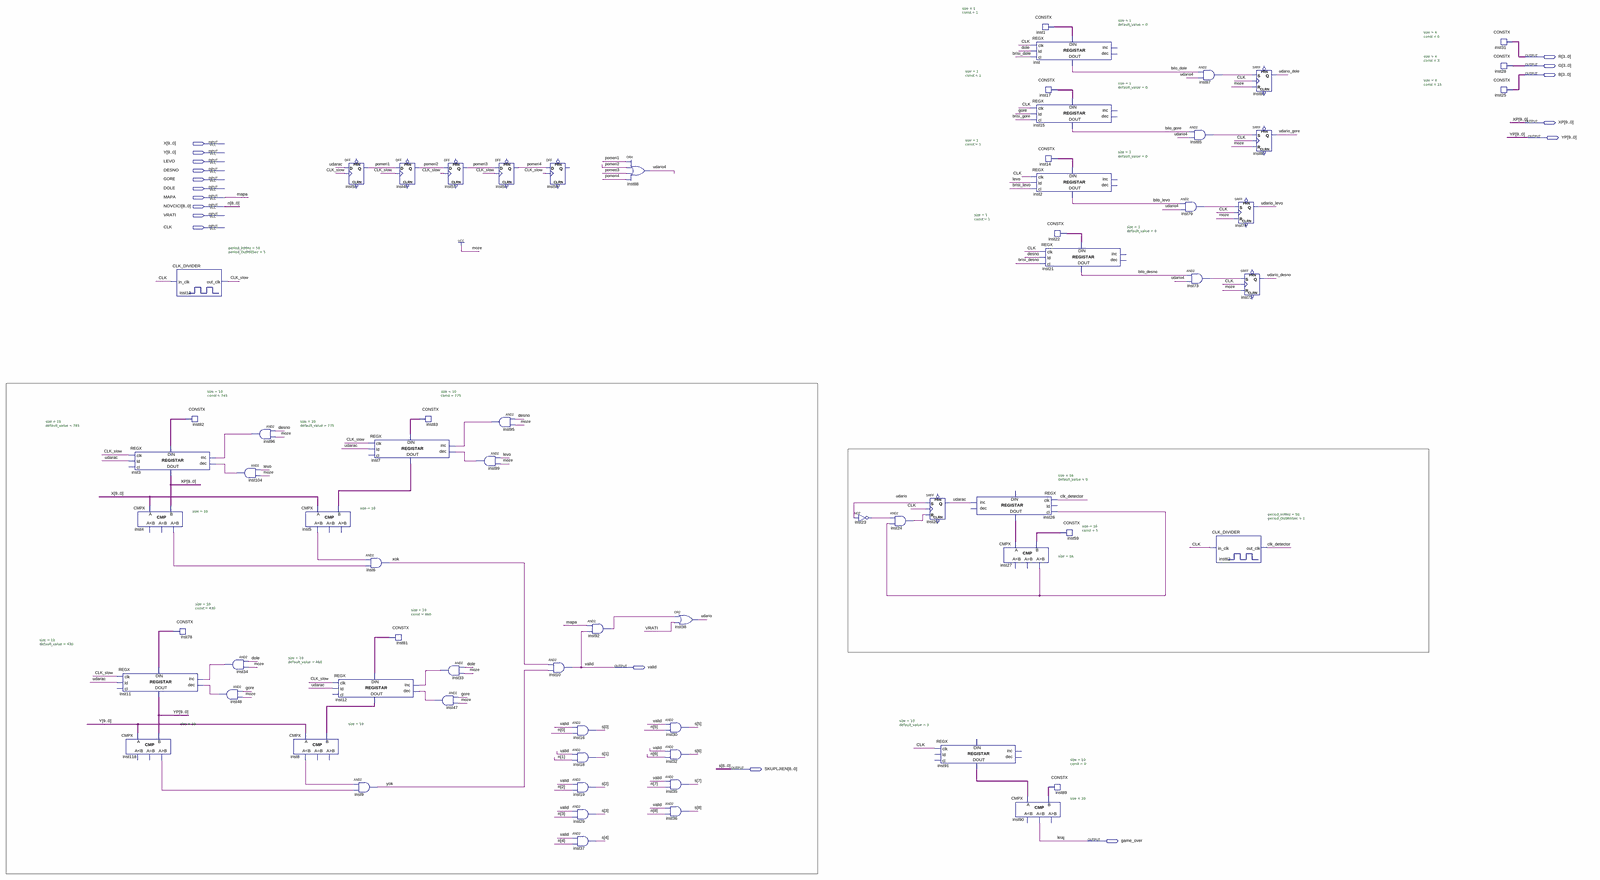
[diagram p0: schematic sheet, whole]
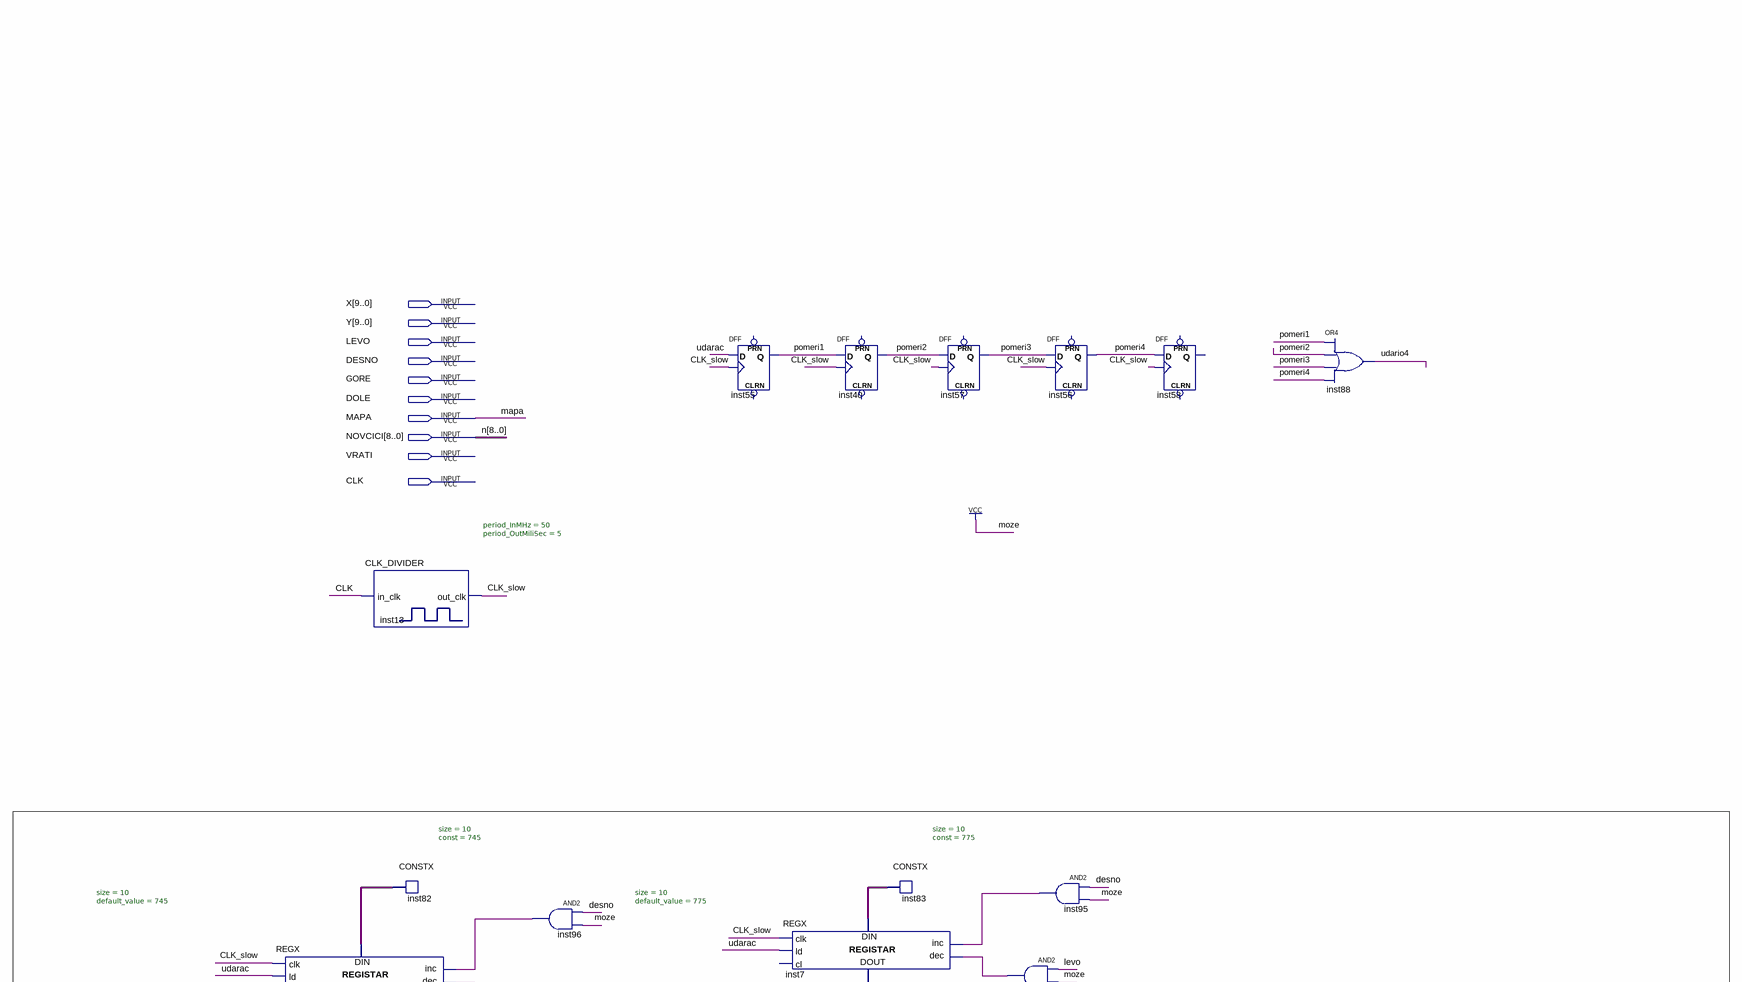
[diagram p1: schematic sheet, upper left part]
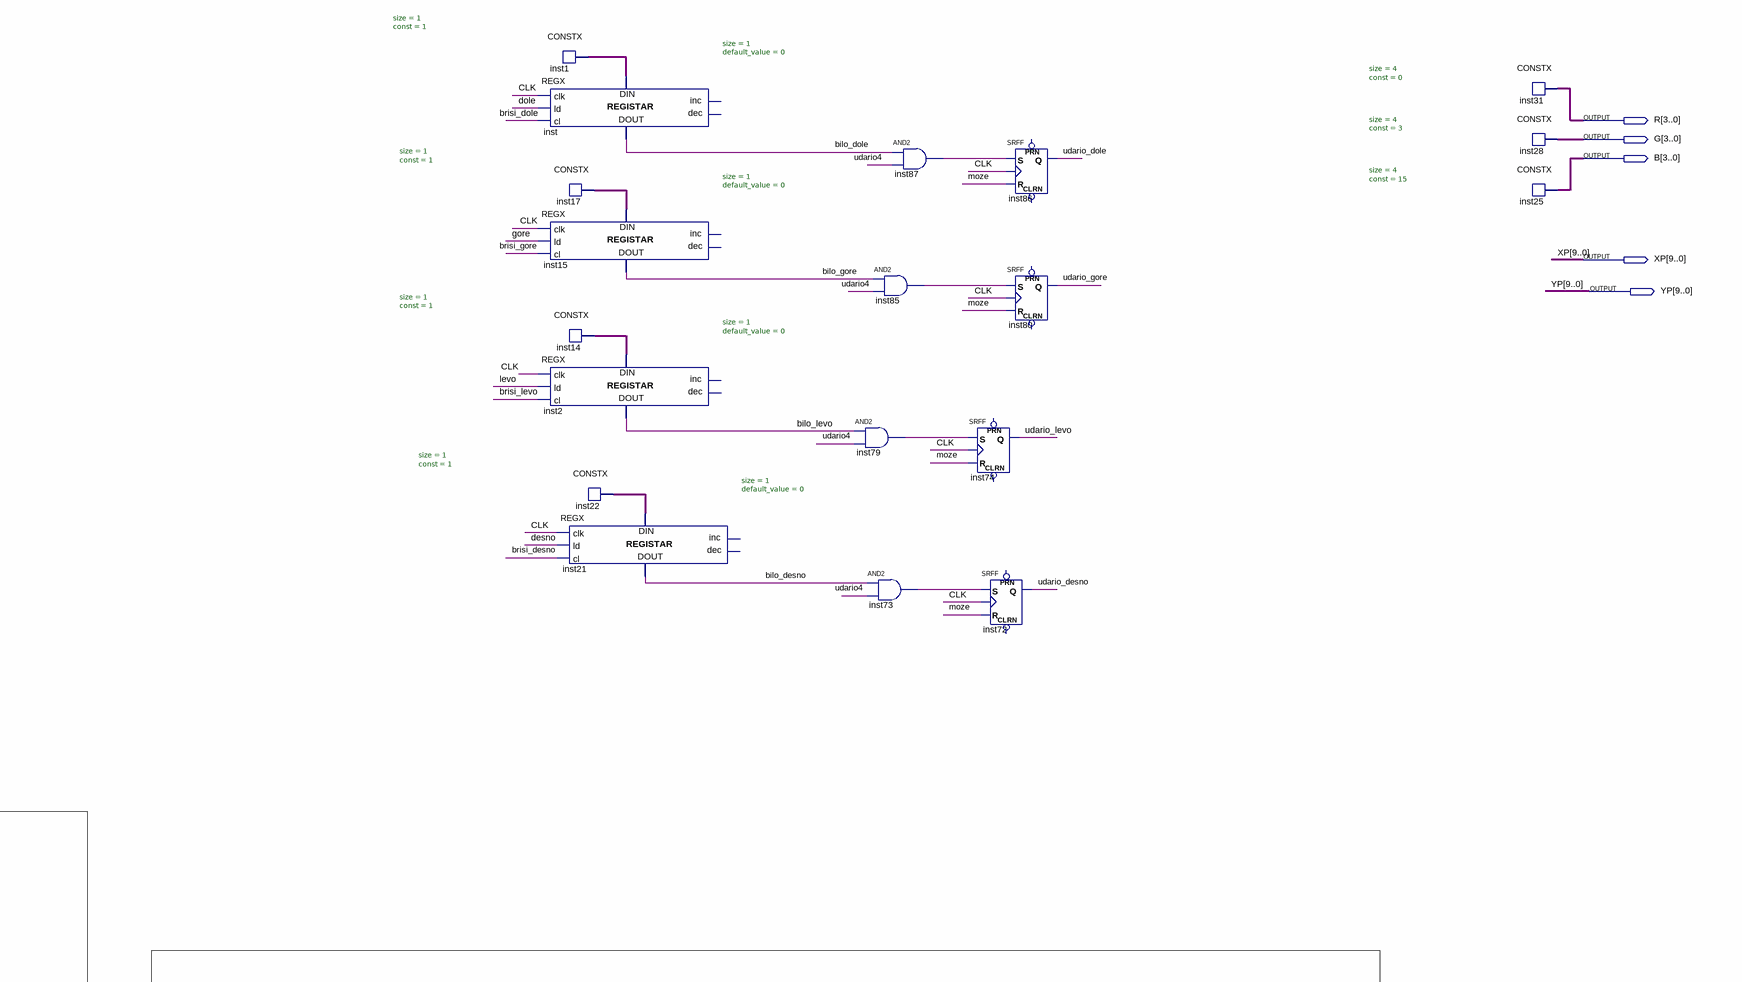
[diagram p2: schematic sheet, upper right part]
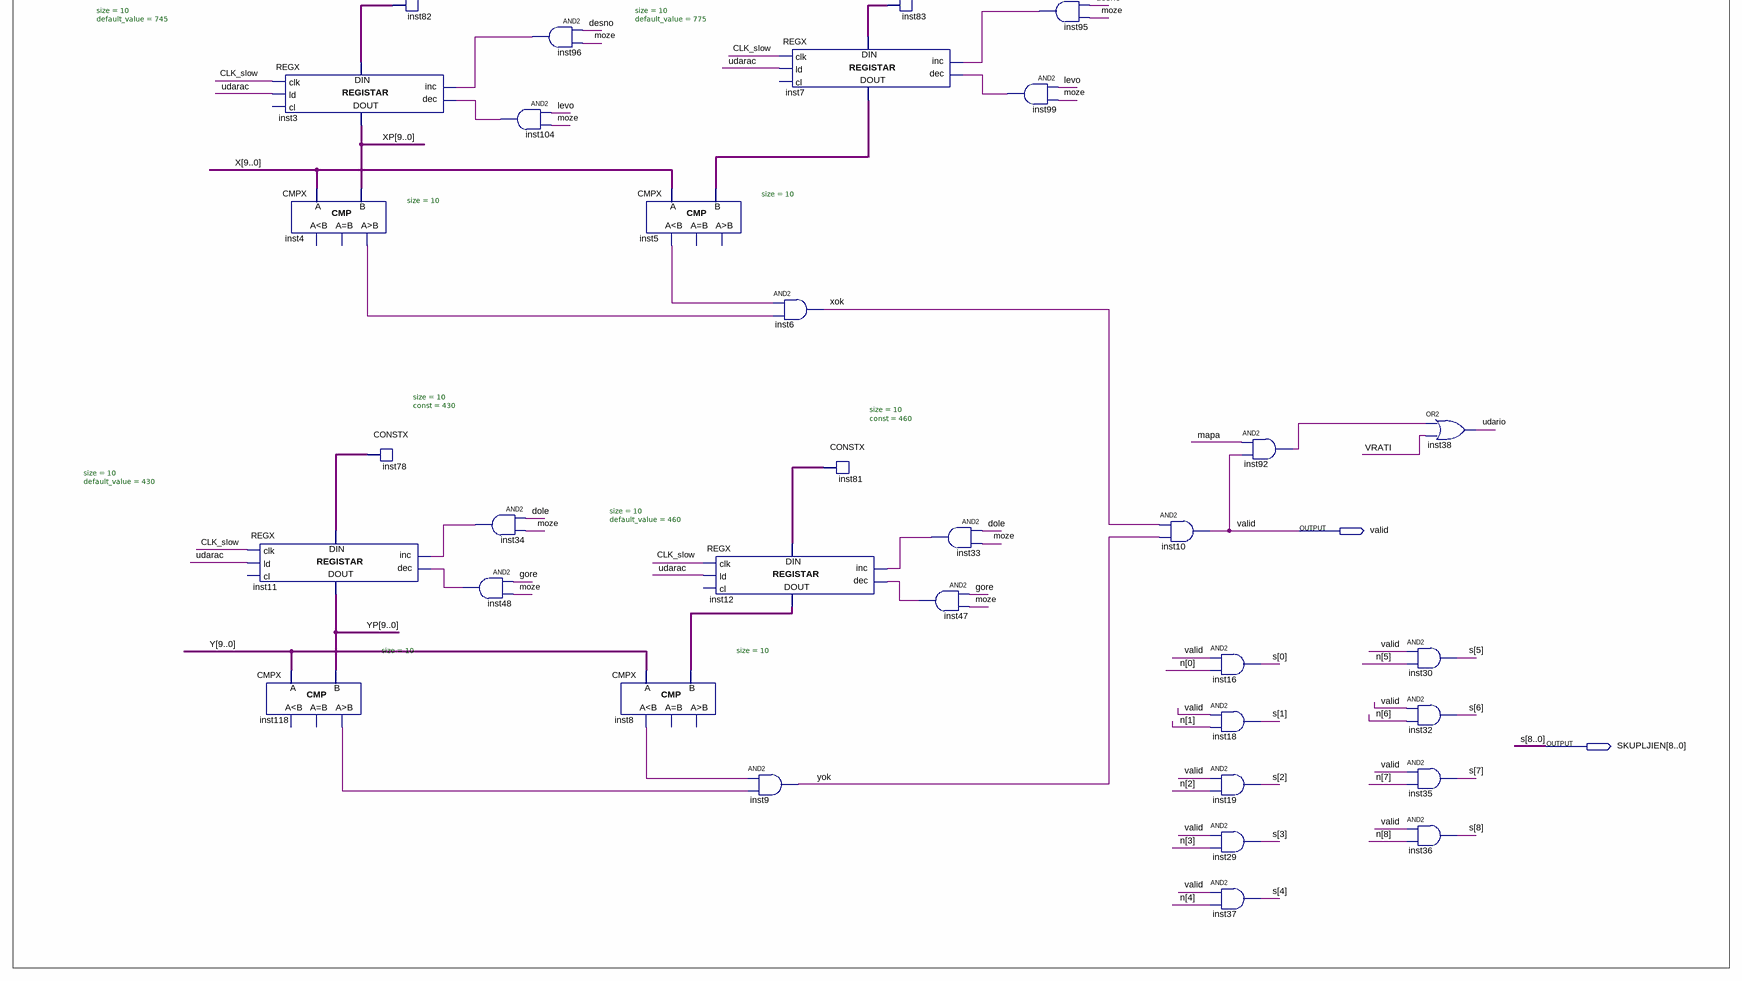
[diagram p3: schematic sheet, lower left part]
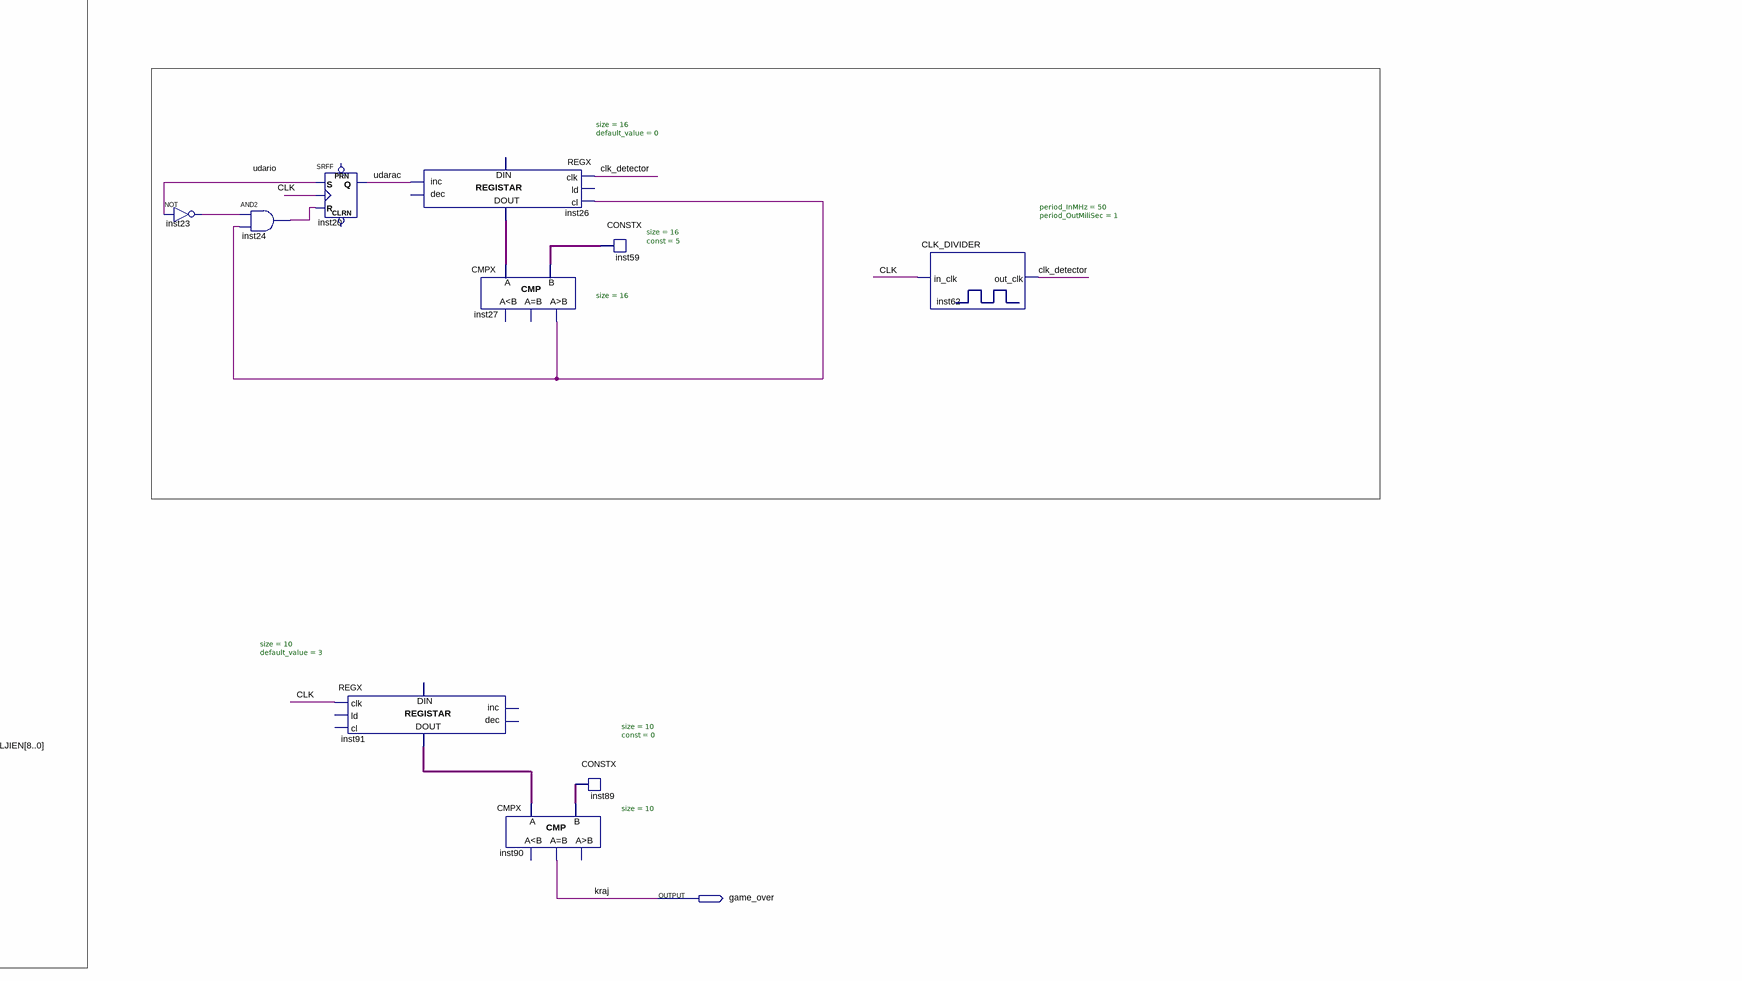
[diagram p4: schematic sheet, lower right part]
// Quartus schematic Igrac2.bdf as structural Verilog: 70 symbols, 18 pins
module Igrac2 (
  input  [9:0] X,
  input  [9:0] Y,
  input  LEVO,
  input  DESNO,
  input  GORE,
  input  DOLE,
  input  MAPA,
  input  [8:0] NOVCICI,
  input  VRATI,
  input  CLK,
  output [3:0] R,
  output [3:0] G,
  output [3:0] B,
  output [9:0] XP,
  output [9:0] YP,
  output valid,
  output [8:0] SKUPLJIEN,
  output game_over
);

  wire bilo_desno, bilo_dole, bilo_gore, bilo_levo, brisi_desno, brisi_dole, brisi_gore, brisi_levo,
       clk_detector, CLK_slow, inst1_data, inst4_gr, inst5_ls, inst8_ls, inst14_data, inst17_data,
       inst22_data, inst23_out, inst24_out, inst27_gr, inst33_out, inst34_out, inst47_out, inst48_out,
       inst73_out, inst79_out, inst85_out, inst87_out, inst92_out, inst95_out, inst96_out, inst99_out,
       inst104_out, inst118_gr, pomeri1, pomeri2, pomeri3, pomeri4, udarac, udario, udario4, udario_desno,
       udario_dole, udario_gore, udario_levo, xok, yok;
  wire [9:0] inst7_data_out, inst12_data_out, inst78_data, inst81_data, inst82_data, inst83_data,
       inst89_data, inst91_data_out;
  wire [15:0] inst26_data_out, inst59_data;

  REGX #(.size(10), .default_value(745)) inst3 (
    .clk(CLK_slow), .ld(udarac), .inc(inst96_out), .dec(inst104_out), .data_in(inst82_data), .data_out(XP));  // open: cl
  REGX #(.size(10), .default_value(430)) inst11 (
    .clk(CLK_slow), .ld(udarac), .inc(inst34_out), .dec(inst48_out), .data_in(inst78_data), .data_out(YP));  // open: cl
  CMPX #(.size(10)) inst118 (.A(Y), .B(YP), .gr(inst118_gr));  // open: ls, eq
  CMPX #(.size(10)) inst4 (.A(X), .B(XP), .gr(inst4_gr));  // open: ls, eq
  CLK_DIVIDER #(.period_InMHz(50), .period_OutMiliSec(5)) inst13 (.in_clk(CLK), .out_clk(CLK_slow));
  CONSTX #(.size(10), .\const (430)) inst78 (.data(inst78_data));
  CONSTX #(.size(10), .\const (745)) inst82 (.data(inst82_data));
  and inst34 (inst34_out, DOLE, 1'b1);
  and inst48 (inst48_out, GORE, 1'b1);
  and inst104 (inst104_out, LEVO, 1'b1);
  and inst96 (inst96_out, DESNO, 1'b1);
  CMPX #(.size(10)) inst8 (.A(Y), .B(inst12_data_out), .ls(inst8_ls));  // open: eq, gr
  CMPX #(.size(10)) inst5 (.A(X), .B(inst7_data_out), .ls(inst5_ls));  // open: eq, gr
  DFF inst55 (.CLK(CLK_slow), .D(udarac), .Q(pomeri1));  // open: CLRN, PRN
  REGX #(.size(10), .default_value(460)) inst12 (
    .clk(CLK_slow), .ld(udarac), .inc(inst33_out), .dec(inst47_out), .data_in(inst81_data),
    .data_out(inst12_data_out));  // open: cl
  REGX #(.size(10), .default_value(775)) inst7 (
    .clk(CLK_slow), .ld(udarac), .inc(inst95_out), .dec(inst99_out), .data_in(inst83_data),
    .data_out(inst7_data_out));  // open: cl
  and inst6 (xok, inst5_ls, inst4_gr);
  and inst9 (yok, inst8_ls, inst118_gr);
  CONSTX #(.size(10), .\const (460)) inst81 (.data(inst81_data));
  DFF inst40 (.CLK(CLK_slow), .D(pomeri1), .Q(pomeri2));  // open: CLRN, PRN
  CONSTX #(.size(10), .\const (775)) inst83 (.data(inst83_data));
  and inst33 (inst33_out, DOLE, 1'b1);
  and inst47 (inst47_out, GORE, 1'b1);
  DFF inst57 (.CLK(CLK_slow), .D(pomeri2), .Q(pomeri3));  // open: CLRN, PRN
  and inst99 (inst99_out, LEVO, 1'b1);
  DFF inst56 (.CLK(CLK_slow), .D(pomeri3), .Q(pomeri4));  // open: CLRN, PRN
  and inst95 (inst95_out, DESNO, 1'b1);
  DFF inst58 (.CLK(CLK_slow), .D(pomeri4));  // open: CLRN, PRN, Q
  and inst10 (valid, xok, yok);
  and inst16 (SKUPLJIEN[0], valid, NOVCICI[0]);
  and inst18 (SKUPLJIEN[1], valid, NOVCICI[1]);
  and inst19 (SKUPLJIEN[2], valid, NOVCICI[2]);
  and inst29 (SKUPLJIEN[3], valid, NOVCICI[3]);
  and inst37 (SKUPLJIEN[4], valid, NOVCICI[4]);
  and inst92 (inst92_out, MAPA, valid);
  or inst88 (udario4, pomeri1, pomeri2, pomeri3, pomeri4);
  or inst38 (udario, inst92_out, VRATI);
  and inst30 (SKUPLJIEN[5], valid, NOVCICI[5]);
  and inst32 (SKUPLJIEN[6], valid, NOVCICI[6]);
  and inst35 (SKUPLJIEN[7], valid, NOVCICI[7]);
  and inst36 (SKUPLJIEN[8], valid, NOVCICI[8]);
  not inst23 (inst23_out, udario);
  and inst24 (inst24_out, inst23_out, inst27_gr);
  SRFF inst20 (.S(udario), .R(inst24_out), .CLK(CLK), .Q(udarac));  // open: PRN, CLRN
  REGX #(.size(10), .default_value(3)) inst91 (
    .clk(CLK), .data_out(inst91_data_out));  // open: ld, cl, inc, dec, data_in
  REGX #(.size(16), .default_value(0)) inst26 (
    .clk(clk_detector), .cl(inst27_gr), .inc(udarac), .data_out(inst26_data_out));  // open: ld, dec, data_in
  CMPX #(.size(16)) inst27 (.A(inst26_data_out), .B(inst59_data), .gr(inst27_gr));  // open: ls, eq
  CMPX #(.size(10)) inst90 (.A(inst91_data_out), .B(inst89_data), .eq(game_over));  // open: ls, gr
  CONSTX #(.size(1), .\const (1)) inst1 (.data(inst1_data));
  REGX #(.size(1), .default_value(0)) inst (
    .clk(CLK), .ld(DOLE), .cl(brisi_dole), .data_in(inst1_data), .data_out(bilo_dole));  // open: inc, dec
  CONSTX #(.size(1), .\const (1)) inst17 (.data(inst17_data));
  REGX #(.size(1), .default_value(0)) inst15 (
    .clk(CLK), .ld(GORE), .cl(brisi_gore), .data_in(inst17_data), .data_out(bilo_gore));  // open: inc, dec
  CONSTX #(.size(1), .\const (1)) inst14 (.data(inst14_data));
  REGX #(.size(1), .default_value(0)) inst2 (
    .clk(CLK), .ld(LEVO), .cl(brisi_levo), .data_in(inst14_data), .data_out(bilo_levo));  // open: inc, dec
  REGX #(.size(1), .default_value(0)) inst21 (
    .clk(CLK), .ld(DESNO), .cl(brisi_desno), .data_in(inst22_data), .data_out(bilo_desno));  // open: inc, dec
  CONSTX #(.size(1), .\const (1)) inst22 (.data(inst22_data));
  CONSTX #(.size(16), .\const (5)) inst59 (.data(inst59_data));
  CONSTX #(.size(10), .\const (0)) inst89 (.data(inst89_data));
  and inst79 (inst79_out, bilo_levo, udario4);
  and inst87 (inst87_out, bilo_dole, udario4);
  and inst85 (inst85_out, bilo_gore, udario4);
  and inst73 (inst73_out, bilo_desno, udario4);
  CLK_DIVIDER #(.period_InMHz(50), .period_OutMiliSec(1)) inst62 (.in_clk(CLK), .out_clk(clk_detector));
  SRFF inst86 (.S(inst87_out), .R(1'b1), .CLK(CLK), .Q(udario_dole));  // open: PRN, CLRN
  SRFF inst80 (.S(inst85_out), .R(1'b1), .CLK(CLK), .Q(udario_gore));  // open: PRN, CLRN
  SRFF inst74 (.S(inst79_out), .R(1'b1), .CLK(CLK), .Q(udario_levo));  // open: PRN, CLRN
  SRFF inst72 (.S(inst73_out), .R(1'b1), .CLK(CLK), .Q(udario_desno));  // open: PRN, CLRN
  CONSTX #(.size(4), .\const (0)) inst31 (.data(R));
  CONSTX #(.size(4), .\const (3)) inst28 (.data(G));
  CONSTX #(.size(4), .\const (15)) inst25 (.data(B));

  // Other names for the same wires on the sheet: kraj = game_over; n[8:0] = NOVCICI; s[8:0] = SKUPLJIEN
endmodule
